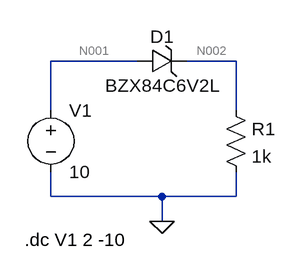
[diagram p0: schematic Zener characteristics.asc]
Zener characteristics.asc, the LTspice schematic file:
Version 4
SHEET 1 880 680
WIRE 160 96 48 96
WIRE 288 96 224 96
WIRE 48 160 48 96
WIRE 288 160 288 96
WIRE 48 272 48 240
WIRE 192 272 48 272
WIRE 288 272 288 240
WIRE 288 272 192 272
WIRE 192 304 192 272
FLAG 192 304 0
SYMBOL res 272 144 R0
SYMATTR InstName R1
SYMATTR Value 1k
SYMBOL voltage 48 144 R0
WINDOW 123 0 0 Left 0
WINDOW 39 0 0 Left 0
SYMATTR InstName V1
SYMATTR Value 10
SYMBOL zener 160 112 R270
WINDOW 0 32 32 VTop 2
WINDOW 3 0 32 VBottom 2
SYMATTR InstName D1
SYMATTR Value BZX84C6V2L
SYMATTR Description Diode
SYMATTR Type diode
TEXT 14 328 Left 2 !.dc V1 2 -10

The netlist it stands for:
* Zener characteristics.asc
R1 N002 0 1k
V1 N001 0 10
D1 N001 N002 BZX84C6V2L
.model D D
.lib standard.dio
.dc V1 2 -10
.backanno
.end

* Results of the author's LTspice run, read from the files saved beside the schematic
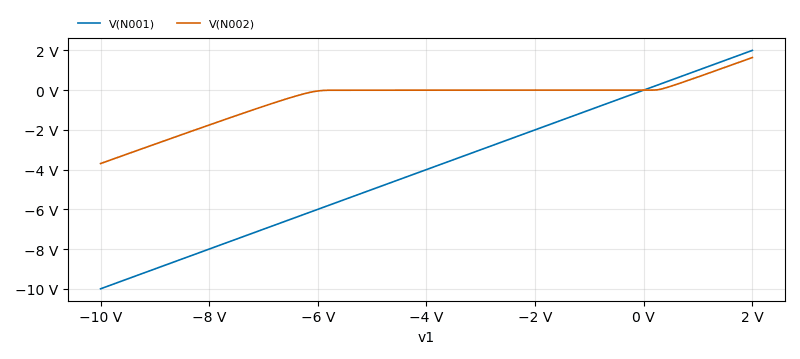
[diagram p1: DC transfer characteristic of Zener characteristics.asc, plotted from the saved traces]
* DC transfer characteristic, 1 run:
*   V(N001): 2 V at v1=2 V, -10 V at v1=-10 V, min -10 V, max 2 V
*   V(N002): 1.64 V at v1=2 V, -3.697 V at v1=-10 V, min -3.697 V, max 1.64 V